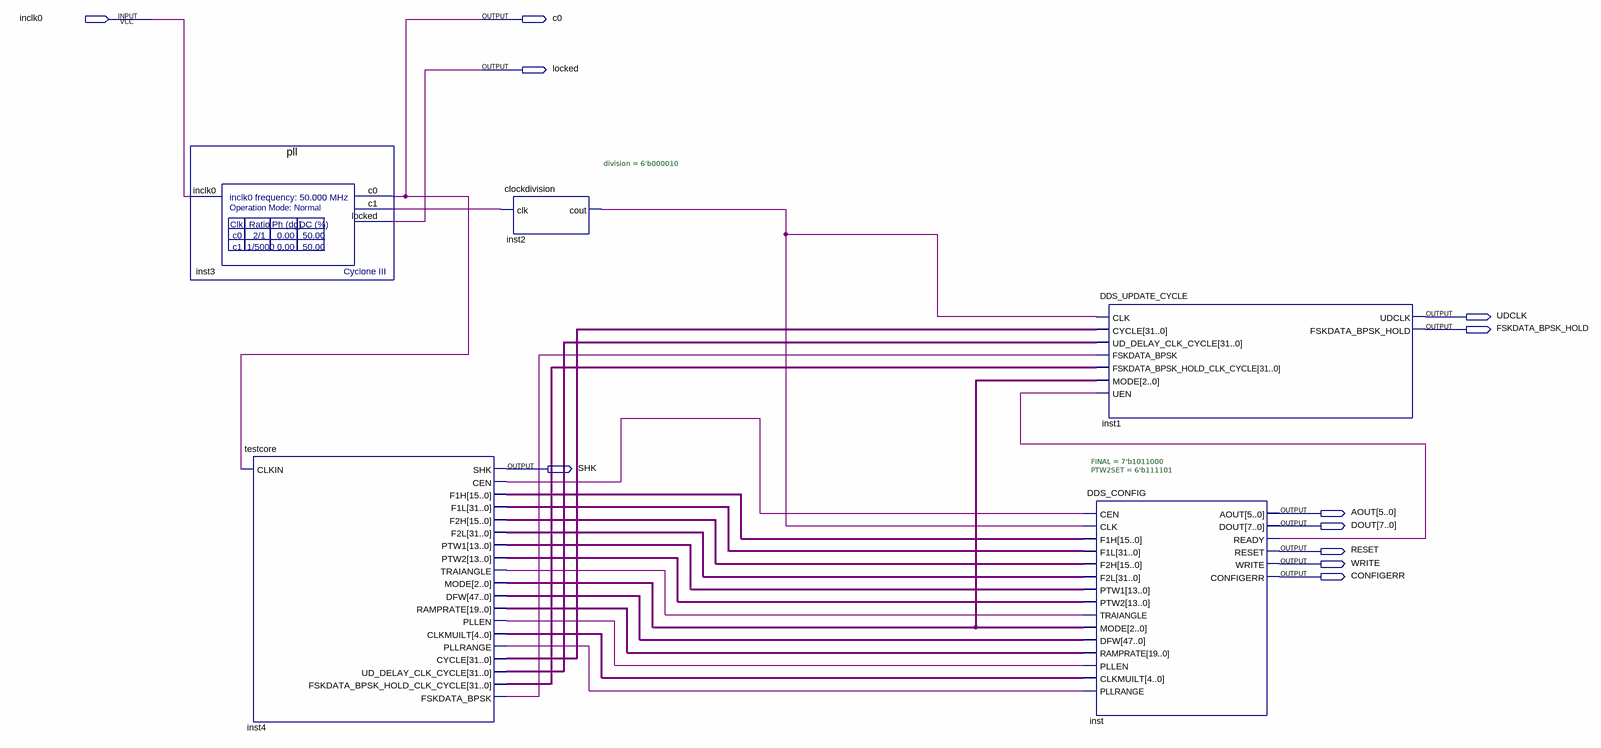
[diagram p0: schematic sheet]
// Quartus schematic system.bdf as structural Verilog: 5 symbols, 11 pins
module system (
  input  inclk0,
  output c0,
  output locked,
  output UDCLK,
  output FSKDATA_BPSK_HOLD,
  output SHK,
  output [5:0] AOUT,
  output [7:0] DOUT,
  output RESET,
  output WRITE,
  output CONFIGERR
);

  wire inst2_cout, inst3_c1, inst4_cen, inst4_fskdata_bpsk, inst4_pllen, inst4_pllrange, inst4_traiangle,
       inst_ready;
  wire [2:0] inst4_mode;
  wire [4:0] inst4_clkmuilt;
  wire [13:0] inst4_ptw1, inst4_ptw2;
  wire [15:0] inst4_f1h, inst4_f2h;
  wire [19:0] inst4_ramprate;
  wire [31:0] inst4_cycle, inst4_f1l, inst4_f2l, inst4_fskdata_bpsk_hold_clk_cycle, inst4_ud_delay_clk_cycle;
  wire [47:0] inst4_dfw;

  pll inst3 (.inclk0(inclk0), .c0(c0), .c1(inst3_c1), .locked(locked));
  testcore inst4 (
    .CLKIN(c0), .SHK(SHK), .CEN(inst4_cen), .F1H(inst4_f1h), .F1L(inst4_f1l), .F2H(inst4_f2h),
    .F2L(inst4_f2l), .PTW1(inst4_ptw1), .PTW2(inst4_ptw2), .TRAIANGLE(inst4_traiangle), .MODE(inst4_mode),
    .DFW(inst4_dfw), .RAMPRATE(inst4_ramprate), .PLLEN(inst4_pllen), .CLKMUILT(inst4_clkmuilt),
    .PLLRANGE(inst4_pllrange), .CYCLE(inst4_cycle), .UD_DELAY_CLK_CYCLE(inst4_ud_delay_clk_cycle),
    .FSKDATA_BPSK_HOLD_CLK_CYCLE(inst4_fskdata_bpsk_hold_clk_cycle), .FSKDATA_BPSK(inst4_fskdata_bpsk));
  clockdivision #(.division(6'b000010)) inst2 (.clk(inst3_c1), .cout(inst2_cout));
  DDS_UPDATE_CYCLE inst1 (
    .CLK(inst2_cout), .CYCLE(inst4_cycle), .UD_DELAY_CLK_CYCLE(inst4_ud_delay_clk_cycle),
    .FSKDATA_BPSK(inst4_fskdata_bpsk), .FSKDATA_BPSK_HOLD_CLK_CYCLE(inst4_fskdata_bpsk_hold_clk_cycle),
    .MODE(inst4_mode), .UEN(inst_ready), .UDCLK(UDCLK), .FSKDATA_BPSK_HOLD(FSKDATA_BPSK_HOLD));
  DDS_CONFIG #(.FINAL(7'b1011000), .PTW2SET(6'b111101)) inst (
    .CEN(inst4_cen), .CLK(inst2_cout), .F1H(inst4_f1h), .F1L(inst4_f1l), .F2H(inst4_f2h), .F2L(inst4_f2l),
    .PTW1(inst4_ptw1), .PTW2(inst4_ptw2), .TRAIANGLE(inst4_traiangle), .MODE(inst4_mode), .DFW(inst4_dfw),
    .RAMPRATE(inst4_ramprate), .PLLEN(inst4_pllen), .CLKMUILT(inst4_clkmuilt), .PLLRANGE(inst4_pllrange),
    .AOUT(AOUT), .DOUT(DOUT), .READY(inst_ready), .RESET(RESET), .WRITE(WRITE), .CONFIGERR(CONFIGERR));
endmodule
